# EAGLE board Payload-A (EAGLE 8.6.3), part 1 of 2
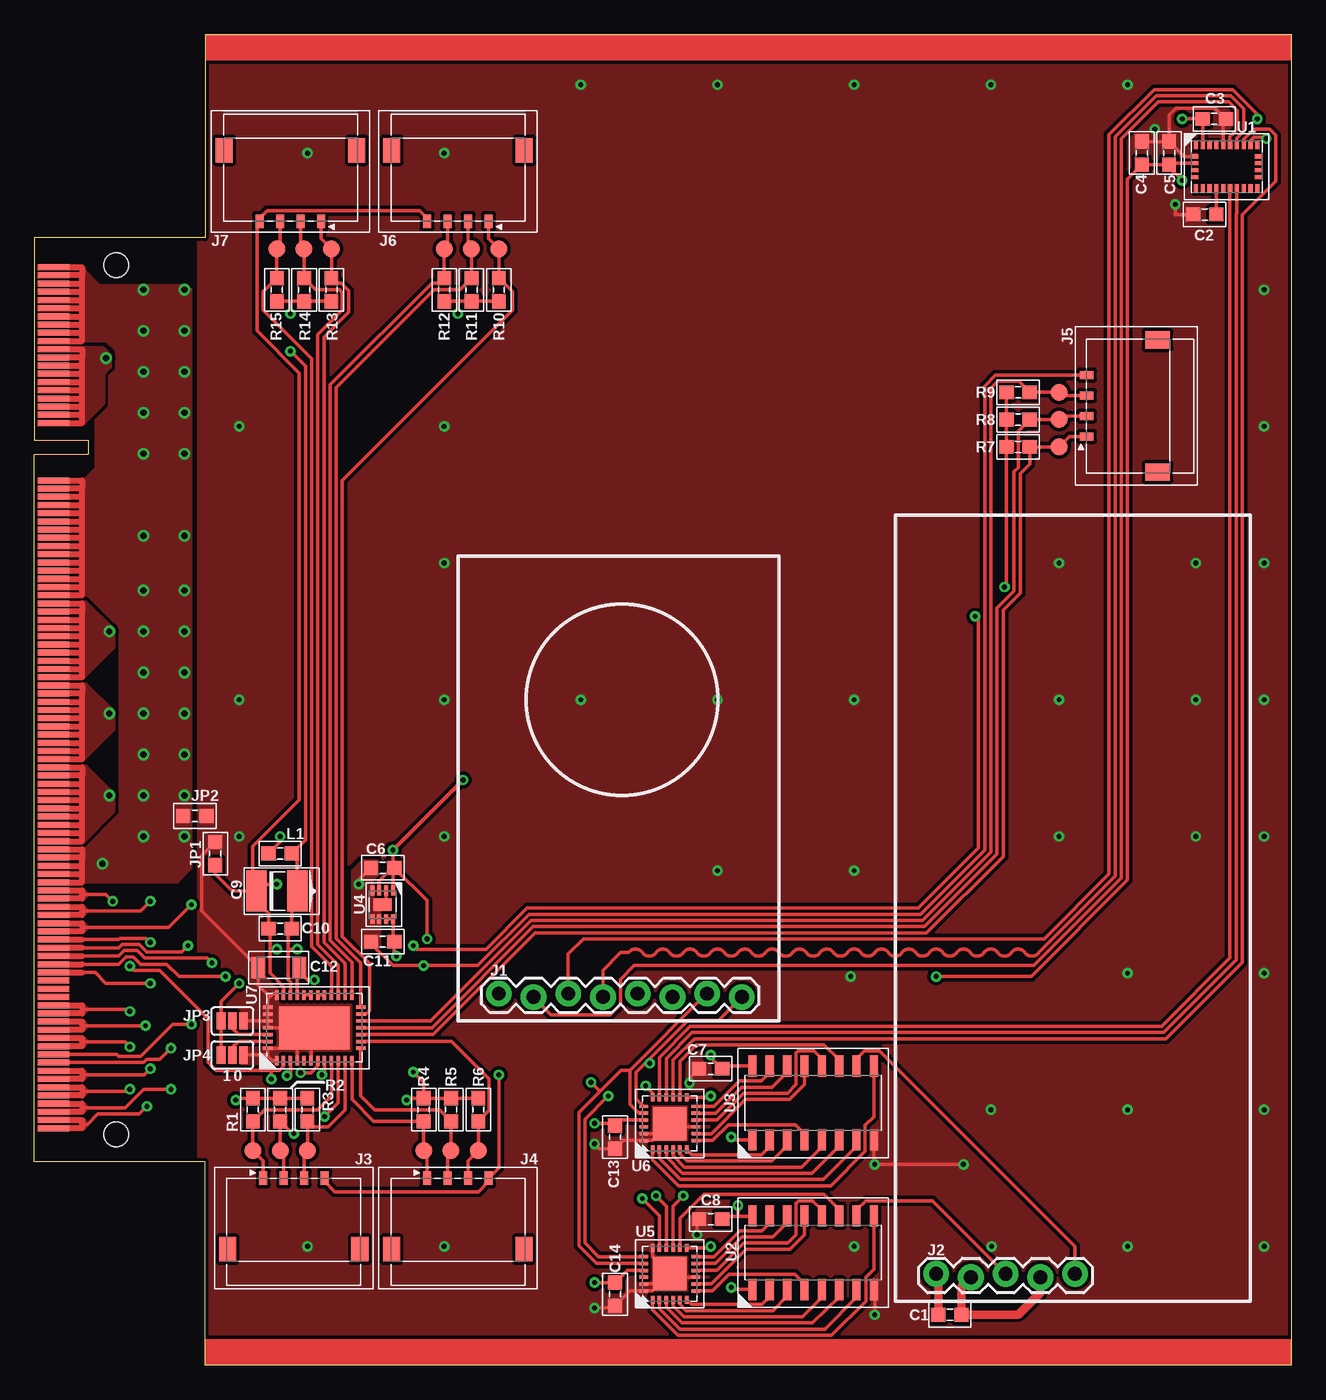
[diagram p1: board, top side]
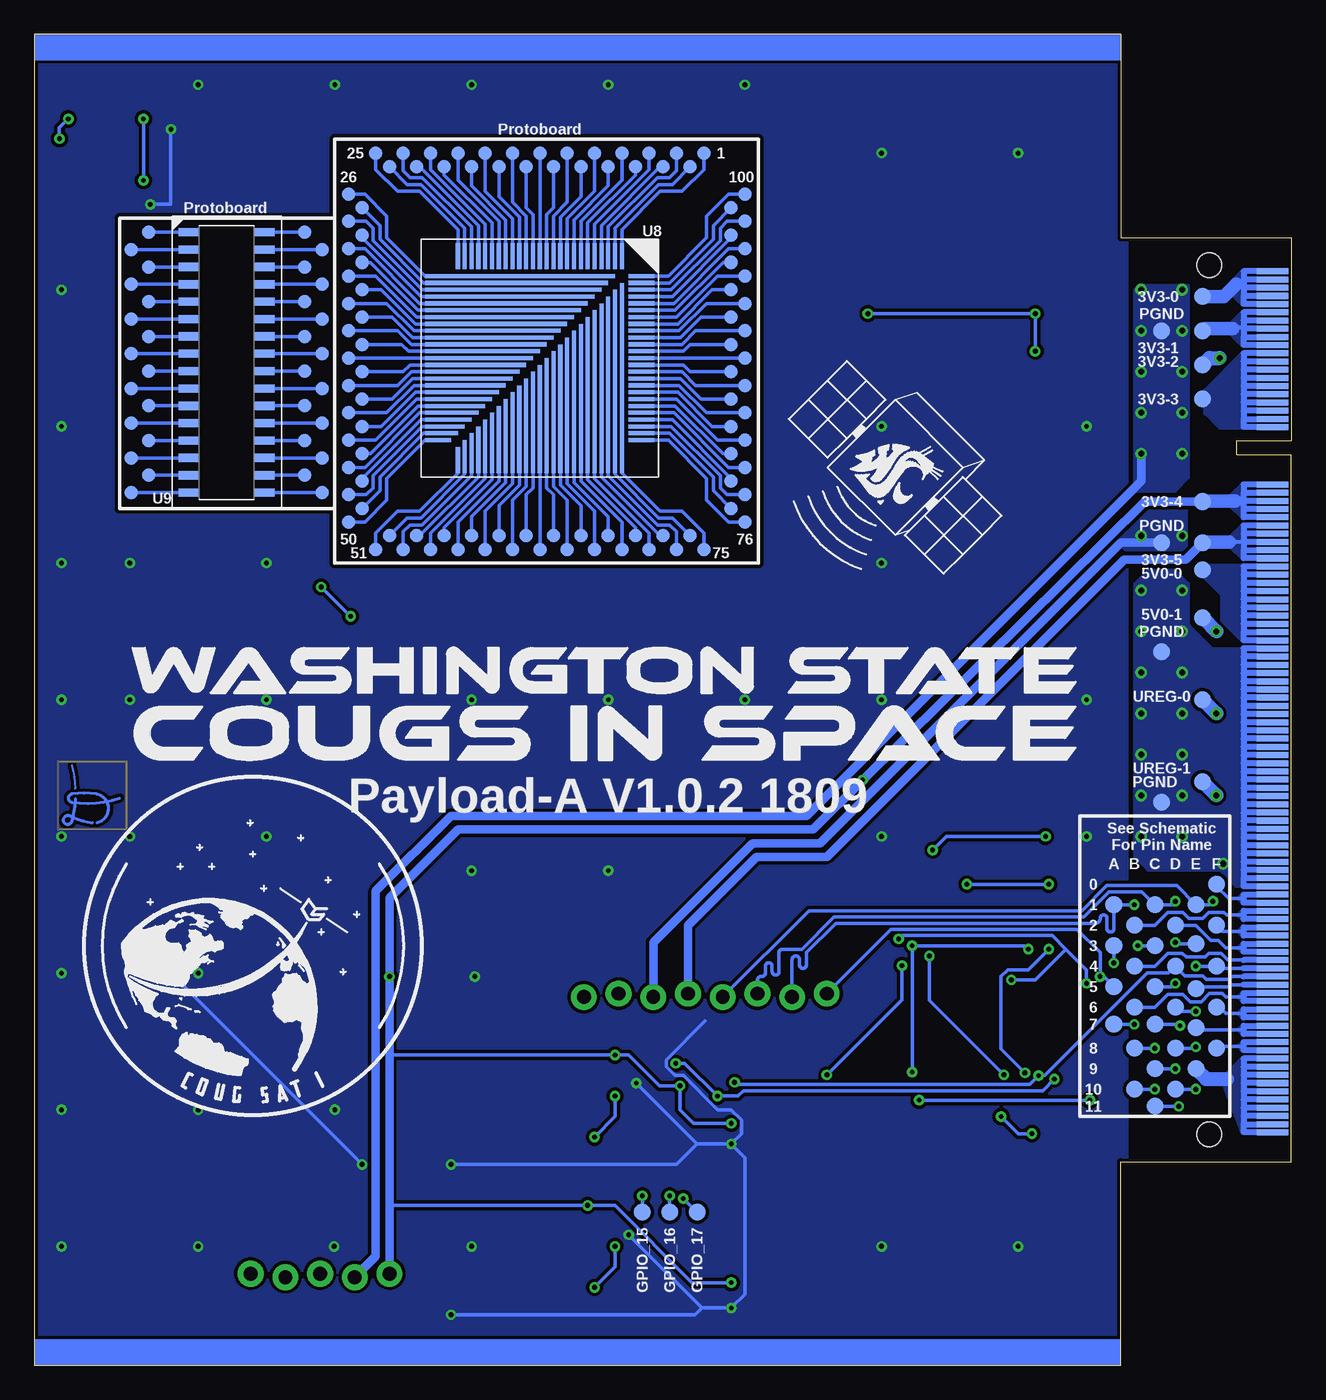
[diagram p2: board, bottom side, seen from below]

Size 92 x 97.4 mm. Coordinates in mm from the lower left corner, seen from the top.
Copper layers (1*16): Top 0.035mm / dielectric 0.9mm / Bottom 0.035mm
Design rules "JLCPCB": minimum track width 6mil, minimum drill 0.3mm, track to track 6mil, track to pad 6mil, pad to pad 6mil, via to via 6mil, smd to smd 6mil, copper to edge 8mil, drill to drill 6mil, minimum pad ring 10mil, minimum via ring 8mil, stop-mask expansion 4mil, vias tented up to drill 20mil, thermal gap 10mil
bRestrict: 8 lines

## Footprints (pad centres in the part's own frame; a part is rotated, then mirrored left to right if it is on the bottom)
1608 = smd 1.05 x 1: 1 -0.85,0; 2 0.85,0
4028-POL = smd 1.5 x 3: A 1.5,0; C -1.5,0
3216 = smd 1 x 1.6: 1 -1.5,0; 2 1.5,0
1X08_LOCK = drill 1.016 pad 1.88: 1 0,0; 2 2.54,-0.254; 3 5.08,0; 4 7.62,-0.254; 5 10.16,0; 6 12.7,-0.254; 7 15.24,0; 8 17.78,-0.254
1X05_LOCK = drill 1.016 pad 1.88: 1 0,0; 2 2.54,-0.254; 3 5.08,0; 4 7.62,-0.254; 5 10.16,0
1X04_PICOLOCK1.5MM = smd 0.6 x 1: 1 2.25,0; 2 0.75,0; 3 -0.75,0; 4 -2.25,0 | smd 1.25 x 1.8: PAD@1 4.855,5.2; PAD@2 -4.833,5.2
COUGSATBUS_MALE-SODIMM = smd 2.3 x 0.44: 1 1.4,31.65; 3 1.4,31.05; 5 1.4,30.45; 7 1.4,29.85; 9 1.4,29.25; 11 1.4,28.65; 13 1.4,28.05; 15 1.4,27.45; 17 1.4,26.85; 19 1.4,26.25; 21 1.4,25.65; 23 1.4,25.05; 25 1.4,24.45; 27 1.4,23.85; 29 1.4,23.25; 31 1.4,22.65; 33 1.4,22.05; 35 1.4,21.45; 37 1.4,20.85; 39 1.4,20.25; 41 1.4,16.05; 43 1.4,15.45; 45 1.4,14.85; 47 1.4,14.25; 49 1.4,13.65; 51 1.4,13.05; 53 1.4,12.45; 55 1.4,11.85; 57 1.4,11.25; 59 1.4,10.65; 61 1.4,10.05; 63 1.4,9.45; 65 1.4,8.85; 67 1.4,8.25; 69 1.4,7.65; 71 1.4,7.05; 73 1.4,6.45; 75 1.4,5.85; 77 1.4,5.25; 79 1.4,4.65; 81 1.4,4.05; 83 1.4,3.45; 85 1.4,2.85; 87 1.4,2.25; 89 1.4,1.65; 91 1.4,1.05; 93 1.4,0.45; 95 1.4,-0.15; 97 1.4,-0.75; 99 1.4,-1.35; 101 1.4,-1.95; 103 1.4,-2.55; 105 1.4,-3.15; 107 1.4,-3.75; 109 1.4,-4.35; 111 1.4,-4.95; 113 1.4,-5.55; 115 1.4,-6.15; 117 1.4,-6.75; 119 1.4,-7.35; 121 1.4,-7.95; 123 1.4,-8.55; 125 1.4,-9.15; 127 1.4,-9.75; 129 1.4,-10.35; 131 1.4,-10.95; 133 1.4,-11.55; 135 1.4,-12.15; 137 1.4,-12.75; 139 1.4,-13.35; 141 1.4,-13.95; 143 1.4,-14.55; 145 1.4,-15.15; 147 1.4,-15.75; 149 1.4,-16.35; 151 1.4,-16.95; 153 1.4,-17.55; 155 1.4,-18.15; 157 1.4,-18.75; 159 1.4,-19.35; 161 1.4,-19.95; 163 1.4,-20.55; 165 1.4,-21.15; 167 1.4,-21.75; 169 1.4,-22.35; 171 1.4,-22.95; 173 1.4,-23.55; 175 1.4,-24.15; 177 1.4,-24.75; 179 1.4,-25.35; 181 1.4,-25.95; 183 1.4,-26.55; 185 1.4,-27.15; 187 1.4,-27.75; 189 1.4,-28.35; 191 1.4,-28.95; 193 1.4,-29.55; 195 1.4,-30.15; 197 1.4,-30.75; 199 1.4,-31.35 | smd 2.3 x 0.44 bottom: 2 1.4,31.35; 4 1.4,30.75; 6 1.4,30.15; 8 1.4,29.55; 10 1.4,28.95; 12 1.4,28.35; 14 1.4,27.75; 16 1.4,27.15; 18 1.4,26.55; 20 1.4,25.95; 22 1.4,25.35; 24 1.4,24.75; 26 1.4,24.15; 28 1.4,23.55; 30 1.4,22.95; 32 1.4,22.35; 34 1.4,21.75; 36 1.4,21.15; 38 1.4,20.55; 40 1.4,19.95; 42 1.4,15.75; 44 1.4,15.15; 46 1.4,14.55; 48 1.4,13.95; 50 1.4,13.35; 52 1.4,12.75; 54 1.4,12.15; 56 1.4,11.55; 58 1.4,10.95; 60 1.4,10.35; 62 1.4,9.75; 64 1.4,9.15; 66 1.4,8.55; 68 1.4,7.95; 70 1.4,7.35; 72 1.4,6.75; 74 1.4,6.15; 76 1.4,5.55; 78 1.4,4.95; 80 1.4,4.35; 82 1.4,3.75; 84 1.4,3.15; 86 1.4,2.55; 88 1.4,1.95; 90 1.4,1.35; 92 1.4,0.75; 94 1.4,0.15; 96 1.4,-0.45; 98 1.4,-1.05; 100 1.4,-1.65; 102 1.4,-2.25; 104 1.4,-2.85; 106 1.4,-3.45; 108 1.4,-4.05; 110 1.4,-4.65; 112 1.4,-5.25; 114 1.4,-5.85; 116 1.4,-6.45; 118 1.4,-7.05; 120 1.4,-7.65; 122 1.4,-8.25; 124 1.4,-8.85; 126 1.4,-9.45; 128 1.4,-10.05; 130 1.4,-10.65; 132 1.4,-11.25; 134 1.4,-11.85; 136 1.4,-12.45; 138 1.4,-13.05; 140 1.4,-13.65; 142 1.4,-14.25; 144 1.4,-14.85; 146 1.4,-15.45; 148 1.4,-16.05; 150 1.4,-16.65; 152 1.4,-17.25; 154 1.4,-17.85; 156 1.4,-18.45; 158 1.4,-19.05; 160 1.4,-19.65; 162 1.4,-20.25; 164 1.4,-20.85; 166 1.4,-21.45; 168 1.4,-22.05; 170 1.4,-22.65; 172 1.4,-23.25; 174 1.4,-23.85; 176 1.4,-24.45; 178 1.4,-25.05; 180 1.4,-25.65; 182 1.4,-26.25; 184 1.4,-26.85; 186 1.4,-27.45; 188 1.4,-28.05; 190 1.4,-28.65; 192 1.4,-29.25; 194 1.4,-29.85; 196 1.4,-30.45; 198 1.4,-31.05; 200 1.4,-31.65 | hole 1.8: 6,31.8; 6,-31.8
SMT-JUMPER_3_NO_SILK = smd 0.635 x 1.27: 1 -0.813,0; 2 0,0; 3 0.813,0
PAD1.25X1.25 = smd 1.25 x 1.25: 1 0,0
PAD1X1 = smd 1 x 1: 1 0,0
LGA28-4X5MM = smd 0.3 x 0.575: 1 -2.25,1.562; 6 -2.25,-1.562; 7 -1.75,-1.562; 8 -1.25,-1.562; 9 -0.75,-1.562; 10 -0.25,-1.562; 11 0.25,-1.562; 12 0.75,-1.562; 13 1.25,-1.562; 14 1.75,-1.562; 15 2.25,-1.562; 20 2.25,1.562; 21 1.75,1.562; 22 1.25,1.562; 23 0.75,1.562; 24 0.25,1.562; 25 -0.25,1.562; 26 -0.75,1.562; 27 -1.25,1.562; 28 -1.75,1.562 | smd 0.475 x 0.3: 2 -2.312,0.75; 3 -2.312,0.25; 4 -2.312,-0.25; 5 -2.312,-0.75; 16 2.312,-0.75; 17 2.312,-0.25; 18 2.312,0.25; 19 2.312,0.75
SO16 = smd 1.55 x 0.6: 1 -2.7,4.445; 2 -2.7,3.175; 3 -2.7,1.905; 4 -2.7,0.635; 5 -2.7,-0.635; 6 -2.7,-1.905; 7 -2.7,-3.175; 8 -2.7,-4.445; 9 2.7,-4.445; 10 2.7,-3.175; 11 2.7,-1.905; 12 2.7,-0.635; 13 2.7,0.635; 14 2.7,1.905; 15 2.7,3.175; 16 2.7,4.445
WDFN8-2X2 = smd 0.7 x 0.29: 1 -1.05,0.75; 2 -1.05,0.25; 3 -1.05,-0.25; 4 -1.05,-0.75; 5 1.05,-0.75; 6 1.05,-0.25; 7 1.05,0.25; 8 1.05,0.75 | smd 0.9 x 1.3: PAD 0,0
QFN24-4X4 = smd 0.6 x 0.25: 1 -1.9,1.25; 2 -1.9,0.75; 3 -1.9,0.25; 4 -1.9,-0.25; 5 -1.9,-0.75; 6 -1.9,-1.25; 13 1.9,-1.25; 14 1.9,-0.75; 15 1.9,-0.25; 16 1.9,0.25; 17 1.9,0.75; 18 1.9,1.25 | smd 0.25 x 0.6: 7 -1.25,-1.9; 8 -0.75,-1.9; 9 -0.25,-1.9; 10 0.25,-1.9; 11 0.75,-1.9; 12 1.25,-1.9; 19 1.25,1.9; 20 0.75,1.9; 21 0.25,1.9; 22 -0.25,1.9; 23 -0.75,1.9; 24 -1.25,1.9 | smd 2.45 x 2.45: PAD 0,0
QFN38-5X7 = smd 0.25 x 0.7: 1 -2.75,-2.4; 2 -2.25,-2.4; 3 -1.75,-2.4; 4 -1.25,-2.4; 5 -0.75,-2.4; 6 -0.25,-2.4; 7 0.25,-2.4; 8 0.75,-2.4; 9 1.25,-2.4; 10 1.75,-2.4; 11 2.25,-2.4; 12 2.75,-2.4; 20 2.75,2.4; 21 2.25,2.4; 22 1.75,2.4; 23 1.25,2.4; 24 0.75,2.4; 25 0.25,2.4; 26 -0.25,2.4; 27 -0.75,2.4; 28 -1.25,2.4; 29 -1.75,2.4; 30 -2.25,2.4; 31 -2.75,2.4 | smd 0.7 x 0.25: 13 3.4,-1.5; 14 3.4,-1; 15 3.4,-0.5; 16 3.4,0; 17 3.4,0.5; 18 3.4,1; 19 3.4,1.5; 32 -3.4,1.5; 33 -3.4,1; 34 -3.4,0.5; 35 -3.4,0; 36 -3.4,-0.5; 37 -3.4,-1; 38 -3.4,-1.5 | smd 5.15 x 3.15: PAD 0,0
PROTOBOARD-SMD0.5MM = smd 0.3 x 1.9: 1 -6,-7.45; 2 -5.5,-7.45; 3 -5,-7.45; 4 -4.5,-7.45; 5 -4,-7.45; 6 -3.5,-7.45; 7 -3,-7.45; 8 -2.5,-7.45; 9 -2,-7.45; 10 -1.5,-7.45; 11 -1,-7.45; 12 -0.5,-7.45; 13 0,-7.45; 14 0.5,-7.45; 15 1,-7.45; 16 1.5,-7.45; 17 2,-7.45; 18 2.5,-7.45; 19 3,-7.45; 20 3.5,-7.45; 21 4,-7.45; 22 4.5,-7.45; 23 5,-7.45; 24 5.5,-7.45; 25 6,-7.45; 51 6,7.45 | smd 13.9 x 0.3: 26 1.45,-6 | smd 13.4 x 0.3: 27 1.7,-5.5 | smd 12.9 x 0.3: 28 1.95,-5 | smd 12.4 x 0.3: 29 2.2,-4.5 | smd 11.9 x 0.3: 30 2.45,-4 | smd 11.4 x 0.3: 31 2.7,-3.5 | smd 10.9 x 0.3: 32 2.95,-3 | smd 10.4 x 0.3: 33 3.2,-2.5 | smd 9.9 x 0.3: 34 3.45,-2 | smd 9.4 x 0.3: 35 3.7,-1.5 | smd 8.9 x 0.3: 36 3.95,-1 | smd 8.4 x 0.3: 37 4.2,-0.5 | smd 7.9 x 0.3: 38 4.45,0 | smd 7.4 x 0.3: 39 4.7,0.5 | smd 6.9 x 0.3: 40 4.95,1 | smd 6.4 x 0.3: 41 5.2,1.5 | smd 5.9 x 0.3: 42 5.45,2 | smd 5.4 x 0.3: 43 5.7,2.5 | smd 4.9 x 0.3: 44 5.95,3 | smd 4.4 x 0.3: 45 6.2,3.5 | smd 3.9 x 0.3: 46 6.45,4 | smd 3.4 x 0.3: 47 6.7,4.5 | smd 2.9 x 0.3: 48 6.95,5 | smd 2.4 x 0.3: 49 7.2,5.5 | smd 1.9 x 0.3: 50 7.45,6; 76 -7.45,6; 77 -7.45,5.5; 78 -7.45,5; 79 -7.45,4.5; 80 -7.45,4; 81 -7.45,3.5; 82 -7.45,3; 83 -7.45,2.5; 84 -7.45,2; 85 -7.45,1.5; 86 -7.45,1; 87 -7.45,0.5; 88 -7.45,0; 89 -7.45,-0.5; 90 -7.45,-1; 91 -7.45,-1.5; 92 -7.45,-2; 93 -7.45,-2.5; 94 -7.45,-3; 95 -7.45,-3.5; 96 -7.45,-4; 97 -7.45,-4.5; 98 -7.45,-5; 99 -7.45,-5.5; 100 -7.45,-6 | smd 0.3 x 2.4: 52 5.5,7.2 | smd 0.3 x 2.9: 53 5,6.95 | smd 0.3 x 3.4: 54 4.5,6.7 | smd 0.3 x 3.9: 55 4,6.45 | smd 0.3 x 4.4: 56 3.5,6.2 | smd 0.3 x 4.9: 57 3,5.95 | smd 0.3 x 5.4: 58 2.5,5.7 | smd 0.3 x 5.9: 59 2,5.45 | smd 0.3 x 6.4: 60 1.5,5.2 | smd 0.3 x 6.9: 61 1,4.95 | smd 0.3 x 7.4: 62 0.5,4.7 | smd 0.3 x 7.9: 63 0,4.45 | smd 0.3 x 8.4: 64 -0.5,4.2 | smd 0.3 x 8.9: 65 -1,3.95 | smd 0.3 x 9.4: 66 -1.5,3.7 | smd 0.3 x 9.9: 67 -2,3.45 | smd 0.3 x 10.4: 68 -2.5,3.2 | smd 0.3 x 10.9: 69 -3,2.95 | smd 0.3 x 11.4: 70 -3.5,2.7 | smd 0.3 x 11.9: 71 -4,2.45 | smd 0.3 x 12.4: 72 -4.5,2.2 | smd 0.3 x 12.9: 73 -5,1.95 | smd 0.3 x 13.4: 74 -5.5,1.7 | smd 0.3 x 13.9: 75 -6,1.45
PROTOBOARD-SOIC = smd 0.6 x 1.52: 1 -3.81,-2.76; 2 -2.54,-2.76; 3 -1.27,-2.76; 4 0,-2.76; 5 1.27,-2.76; 6 2.54,-2.76; 7 3.81,-2.76; 8 5.08,-2.76; 9 6.35,-2.76; 10 7.62,-2.76; 11 8.89,-2.76; 12 10.16,-2.76; 13 11.43,-2.76; 14 12.7,-2.76; 15 13.97,-2.76; 16 15.24,-2.76; 17 15.24,2.76; 18 13.97,2.76; 19 12.7,2.76; 20 11.43,2.76; 21 10.16,2.76; 22 8.89,2.76; 23 7.62,2.76; 24 6.35,2.76; 25 5.08,2.76; 26 3.81,2.76; 27 2.54,2.76; 28 1.27,2.76; 29 0,2.76; 30 -1.27,2.76; 31 -2.54,2.76; 32 -3.81,2.76

## Placement (x,y rotation side)
C1  100nF  [1608]  67,3.7 0 top
C2  100nF  [1608]  85.65,84.2 180 top
C3  100nF  [1608]  86.35,91.2 0 top
C4  100nF  [1608]  81.05,88.7 90 top
C5  6.8nF  [1608]  83.05,88.7 90 top
C6  100nF  [1608]  25.5,36.4 180 top
C7  100nF  [1608]  49.5,21.7 180 top
C8  100nF  [1608]  49.5,10.7 180 top
C9  10µF  [4028-POL]  17.75,34.7 0 top
C10  100nF  [1608]  18,31.95 180 top
C11  270pF  [1608]  25.5,31 180 top
C12  100nF  [3216]  17.9,29.1 180 top
C13  100nF  [1608]  42.5,16.7 270 top
C14  100nF  [1608]  42.5,5.2 270 top
IMG1  COUGSINSPACELOGOTEXT  [COUGSINSPACETEXT]  50,48.7 0 bottom
IMG2  COUGSINSPACELOGOSMALL  [COUGSINSPACELOGO_SMALL]  29,65.7 0 bottom
IMG3  COUGSINSPACELOGOMEDIUM  [COUGSINSPACELOGO_MEDIUM]  76,30.7 0 bottom
IMG4  SIGNATUREBRADLEY  [SIGNATURE-BRADLEY]  87.75,41.7 0 bottom
J1  ArduCAM Mini 5MP  [1X08_LOCK]  34,27.2 0 top
J2  CONN_05TH-LOCK  [1X05_LOCK]  66,6.7 0 top
J3  [1X04_PICOLOCK1.5MM]  19,13.7 180 top
J4  [1X04_PICOLOCK1.5MM]  31,13.7 180 top
J5  [1X04_PICOLOCK1.5MM]  77,70.2 270 top
J6  [1X04_PICOLOCK1.5MM]  31,83.7 0 top
J7  [1X04_PICOLOCK1.5MM]  18.75,83.7 0 top
J8  COUGSATBUSCARD  [COUGSATBUS_MALE-SODIMM]  0,48.7 0 top
JP1  [1608]  13.25,37.45 90 top
JP2  [1608]  11.75,40.2 180 top
JP3  [SMT-JUMPER_3_NO_SILK]  14.5,25.2 0 top
JP4  [SMT-JUMPER_3_NO_SILK]  14.5,22.7 0 top
L1  BLM18HE152SN1  [1608]  18,37.45 180 top
R1  220kΩ  [1608]  16,18.7 90 top
R2  220kΩ  [1608]  18,18.7 90 top
R3  220kΩ  [1608]  20,18.7 90 top
R4  220kΩ  [1608]  28.5,18.7 90 top
R5  220kΩ  [1608]  30.5,18.7 90 top
R6  220kΩ  [1608]  32.5,18.7 90 top
R7  220kΩ  [1608]  72,67.2 180 top
R8  220kΩ  [1608]  72,69.2 180 top
R9  220kΩ  [1608]  72,71.2 180 top
R10  220kΩ  [1608]  34,78.7 270 top
R11  220kΩ  [1608]  32,78.7 270 top
R12  220kΩ  [1608]  30,78.7 270 top
R13  220kΩ  [1608]  21.75,78.7 270 top
R14  220kΩ  [1608]  19.75,78.7 270 top
R15  220kΩ  [1608]  17.75,78.7 270 top
TP1  [PAD1.25X1.25]  47.5,11.2 0 bottom
TP2  [PAD1.25X1.25]  45.5,11.2 0 bottom
TP3  [PAD1.25X1.25]  43.5,11.2 0 bottom
TP4  [PAD1.25X1.25]  16,15.7 0 top
TP5  [PAD1.25X1.25]  18,15.7 0 top
TP6  [PAD1.25X1.25]  20,15.7 0 top
TP7  [PAD1.25X1.25]  28.5,15.7 0 top
TP8  [PAD1.25X1.25]  30.5,15.7 0 top
TP9  [PAD1.25X1.25]  32.5,15.7 0 top
TP10  [PAD1.25X1.25]  75,67.2 0 top
TP11  [PAD1.25X1.25]  75,69.2 0 top
TP12  [PAD1.25X1.25]  75,71.2 0 top
TP13  [PAD1.25X1.25]  34,81.7 90 top
TP14  [PAD1.25X1.25]  32,81.7 90 top
TP15  [PAD1.25X1.25]  30,81.7 90 top
TP16  [PAD1.25X1.25]  21.75,81.7 180 top
TP17  [PAD1.25X1.25]  19.75,81.7 180 top
TP18  [PAD1.25X1.25]  17.75,81.7 180 top
TP19  [PAD1.25X1.25]  10,24.95 0 bottom
TP20  [PAD1.25X1.25]  8.5,26.2 0 bottom
TP21  [PAD1.25X1.25]  8.5,23.2 270 bottom
TP22  [PAD1.25X1.25]  5.5,29.2 270 bottom
TP23  [PAD1.25X1.25]  8.5,29.2 270 bottom
TP24  [PAD1.25X1.25]  7,27.55 270 bottom
TP25  [PAD1.25X1.25]  10,21.7 270 bottom
TP26  [PAD1.25X1.25]  8.5,20.2 270 bottom
TP27  [PAD1.25X1.25]  11.5,20.2 270 bottom
TP28  [PAD1.25X1.25]  10,18.95 270 bottom
TP29  [PAD1.25X1.25]  10,33.7 270 bottom
TP30  [PAD1.25X1.25]  13,33.7 270 bottom
TP31  [PAD1.25X1.25]  7,33.7 270 bottom
TP32  [PAD1.25X1.25]  7,24.7 270 bottom
TP33  [PAD1.25X1.25]  5.5,23.2 270 bottom
TP34  [PAD1.25X1.25]  7,30.85 270 bottom
TP35  [PAD1.25X1.25]  10,30.7 270 bottom
TP36  [PAD1.25X1.25]  13,30.7 270 bottom
TP37  [PAD1.25X1.25]  11.5,29.2 270 bottom
TP38  [PAD1.25X1.25]  13,27.7 270 bottom
TP39  [PAD1.25X1.25]  10,27.7 270 bottom
TP40  [PAD1X1]  43,88.7 0 bottom
TP41  [PAD1X1]  44,87.7 0 bottom
TP42  [PAD1X1]  45,88.7 0 bottom
TP43  [PAD1X1]  46,87.7 270 bottom
TP44  [PAD1X1]  47,88.7 270 bottom
TP45  [PAD1X1]  48,87.7 270 bottom
TP46  [PAD1X1]  49,88.7 270 bottom
TP47  [PAD1X1]  50,87.7 270 bottom
TP48  [PAD1X1]  51,88.7 270 bottom
TP49  [PAD1X1]  52,87.7 270 bottom
TP50  [PAD1X1]  67,59.7 90 bottom
TP51  [PAD1X1]  66,60.7 90 bottom
TP52  [PAD1X1]  65,59.7 90 bottom
TP53  [PAD1X1]  64,60.7 90 bottom
TP54  [PAD1X1]  63,59.7 90 bottom
TP55  [PAD1X1]  62,60.7 90 bottom
TP56  [PAD1X1]  61,59.7 90 bottom
TP57  [PAD1X1]  60,60.7 90 bottom
TP58  [PAD1X1]  59,59.7 90 bottom
TP59  [PAD1X1]  58,60.7 90 bottom
TP60  [PAD1X1]  53,88.7 270 bottom
TP61  [PAD1X1]  54,87.7 270 bottom
TP62  [PAD1X1]  55,88.7 270 bottom
TP63  [PAD1X1]  56,87.7 270 bottom
TP64  [PAD1X1]  57,88.7 270 bottom
TP65  [PAD1X1]  58,87.7 270 bottom
TP66  [PAD1X1]  59,88.7 270 bottom
TP67  [PAD1X1]  60,87.7 270 bottom
TP68  [PAD1X1]  61,88.7 270 bottom
TP69  [PAD1X1]  62,87.7 270 bottom
TP70  [PAD1X1]  57,59.7 90 bottom
TP71  [PAD1X1]  56,60.7 90 bottom
TP72  [PAD1X1]  55,59.7 90 bottom
TP73  [PAD1X1]  54,60.7 90 bottom
TP74  [PAD1X1]  53,59.7 90 bottom
TP75  [PAD1X1]  52,60.7 90 bottom
TP76  [PAD1X1]  51,59.7 90 bottom
TP77  [PAD1X1]  50,60.7 90 bottom
TP78  [PAD1X1]  49,59.7 90 bottom
TP79  [PAD1X1]  48,60.7 90 bottom
TP80  [PAD1.25X1.25]  11.5,26.2 270 bottom
TP81  [PAD1.25X1.25]  5.5,26.2 270 bottom
TP82  [PAD1.25X1.25]  9.5,41.2 270 bottom
TP83  [PAD1.25X1.25]  9.5,52.2 270 bottom
TP84  [PAD1.25X1.25]  9.5,60.2 270 bottom
TP85  [PAD1.25X1.25]  9.5,75.7 270 bottom
TP86  [PAD1.25X1.25]  6.5,63.2 270 bottom
TP87  [PAD1.25X1.25]  6.5,60.2 270 bottom
TP88  [PAD1.25X1.25]  8.5,32.2 270 bottom
TP89  [PAD1.25X1.25]  5.5,32.2 270 bottom
TP90  [PAD1.25X1.25]  11.5,32.2 270 bottom
TP91  [PAD1.25X1.25]  5.5,35.2 270 bottom
TP92  [PAD1.25X1.25]  13,24.95 0 bottom
TP93  [PAD1.25X1.25]  11.5,23.2 0 bottom
TP94  [PAD1X1]  63,88.7 270 bottom
TP95  [PAD1X1]  64,87.7 270 bottom
TP96  [PAD1X1]  65,88.7 270 bottom
TP97  [PAD1X1]  66,87.7 270 bottom
TP98  [PAD1X1]  67,88.7 270 bottom
TP99  [PAD1X1]  69,85.7 270 bottom
TP100  [PAD1X1]  68,84.7 0 bottom
TP101  [PAD1X1]  69,83.7 0 bottom
TP102  [PAD1X1]  68,82.7 0 bottom
TP103  [PAD1X1]  69,81.7 0 bottom
TP104  [PAD1X1]  47,59.7 90 bottom
TP105  [PAD1X1]  46,60.7 90 bottom
TP106  [PAD1X1]  45,59.7 90 bottom
TP107  [PAD1X1]  44,60.7 90 bottom
TP108  [PAD1X1]  43,59.7 180 bottom
TP109  [PAD1X1]  40,61.7 180 bottom
TP110  [PAD1X1]  41,62.7 180 bottom
TP111  [PAD1X1]  40,63.7 180 bottom
TP112  [PAD1X1]  41,64.7 180 bottom
TP113  [PAD1X1]  40,65.7 180 bottom
TP114  [PAD1X1]  68,80.7 0 bottom
TP115  [PAD1X1]  69,79.7 0 bottom
TP116  [PAD1X1]  68,78.7 0 bottom
TP117  [PAD1X1]  69,77.7 0 bottom
TP118  [PAD1X1]  68,76.7 0 bottom
TP119  [PAD1X1]  69,75.7 0 bottom
TP120  [PAD1X1]  68,74.7 0 bottom
TP121  [PAD1X1]  69,73.7 0 bottom
TP122  [PAD1X1]  68,72.7 0 bottom
TP123  [PAD1X1]  69,71.7 0 bottom
TP124  [PAD1X1]  41,66.7 180 bottom
TP125  [PAD1X1]  40,67.7 180 bottom
TP126  [PAD1X1]  41,68.7 180 bottom
TP127  [PAD1X1]  40,69.7 180 bottom
TP128  [PAD1X1]  41,70.7 180 bottom
TP129  [PAD1X1]  40,71.7 180 bottom
TP130  [PAD1X1]  41,72.7 180 bottom
TP131  [PAD1X1]  40,73.7 180 bottom
TP132  [PAD1X1]  41,74.7 180 bottom
TP133  [PAD1X1]  40,75.7 180 bottom
TP134  [PAD1X1]  68,70.7 0 bottom
TP135  [PAD1X1]  69,69.7 0 bottom
TP136  [PAD1X1]  68,68.7 0 bottom
TP137  [PAD1X1]  69,67.7 0 bottom
TP138  [PAD1X1]  68,66.7 0 bottom
TP139  [PAD1X1]  69,65.7 0 bottom
TP140  [PAD1X1]  68,64.7 0 bottom
TP141  [PAD1X1]  69,63.7 0 bottom
TP142  [PAD1X1]  68,62.7 0 bottom
TP143  [PAD1X1]  69,61.7 0 bottom
TP144  [PAD1X1]  41,76.7 180 bottom
TP145  [PAD1X1]  40,77.7 180 bottom
TP146  [PAD1X1]  41,78.7 180 bottom
TP147  [PAD1X1]  40,79.7 180 bottom
TP148  [PAD1X1]  41,80.7 180 bottom
TP149  [PAD1X1]  40,81.7 180 bottom
TP150  [PAD1X1]  41,82.7 180 bottom
TP151  [PAD1X1]  40,83.7 180 bottom
TP152  [PAD1X1]  41,84.7 180 bottom
TP153  [PAD1X1]  40,85.7 0 bottom
TP154  [PAD1X1]  83.62,82.91 0 bottom
TP155  [PAD1X1]  84.89,81.64 0 bottom
TP156  [PAD1X1]  83.62,80.37 0 bottom
TP157  [PAD1X1]  84.89,79.09 0 bottom
TP158  [PAD1X1]  83.62,77.83 0 bottom
TP159  [PAD1X1]  84.89,76.56 0 bottom
TP160  [PAD1X1]  83.62,75.28 0 bottom
TP161  [PAD1X1]  84.89,74.02 0 bottom
TP162  [PAD1X1]  70.92,63.86 0 bottom
TP163  [PAD1X1]  72.19,65.12 180 bottom
TP164  [PAD1X1]  70.92,66.4 0 bottom
TP165  [PAD1X1]  72.19,67.67 180 bottom
TP166  [PAD1X1]  70.92,68.94 0 bottom
TP167  [PAD1X1]  72.19,70.2 180 bottom
TP168  [PAD1X1]  70.92,71.47 0 bottom
TP169  [PAD1X1]  72.19,72.75 180 bottom
TP170  [PAD1X1]  83.62,72.75 0 bottom
TP171  [PAD1X1]  84.89,71.47 180 bottom
TP172  [PAD1X1]  83.62,70.2 0 bottom
TP173  [PAD1X1]  84.89,68.94 180 bottom
TP174  [PAD1X1]  83.62,67.67 0 bottom
TP175  [PAD1X1]  84.89,66.4 180 bottom
TP176  [PAD1X1]  83.62,65.12 0 bottom
TP177  [PAD1X1]  84.89,63.86 180 bottom
TP178  [PAD1X1]  70.92,74.02 0 bottom
TP179  [PAD1X1]  72.19,75.28 180 bottom
TP180  [PAD1X1]  70.92,76.56 0 bottom
TP181  [PAD1X1]  72.19,77.83 180 bottom
TP182  [PAD1X1]  70.92,79.09 180 bottom
TP183  [PAD1X1]  72.19,80.37 180 bottom
TP184  [PAD1X1]  70.92,81.64 180 bottom
TP185  [PAD1X1]  72.19,82.91 180 bottom
TP186  [PAD1.25X1.25]  6.5,78.2 270 bottom
TP187  [PAD1.25X1.25]  6.5,75.7 270 bottom
TP188  [PAD1.25X1.25]  6.5,73.2 270 bottom
TP189  [PAD1.25X1.25]  6.5,70.7 270 bottom
TP190  [PAD1.25X1.25]  6.5,58.2 270 bottom
TP191  [PAD1.25X1.25]  6.5,54.7 270 bottom
TP192  [PAD1.25X1.25]  6.5,48.7 270 bottom
TP193  [PAD1.25X1.25]  6.5,42.7 270 bottom
TP194  [PAD1.25X1.25]  7,21.7 270 bottom
U1  BMF055  [LGA28-4X5MM]  87.25,87.7 0 top
U2  CD74HC4040M  [SO16]  57,8.25 90 top
U3  CD74HC4040M  [SO16]  57,19.2 90 top
U4  MCP1501-10  [WDFN8-2X2]  25.5,33.7 270 top
U5  TCA9535  [QFN24-4X4]  46.5,6.7 90 top
U6  TCA9535  [QFN24-4X4]  46.5,17.7 90 top
U7  LTC2499  [QFN38-5X7]  20.5,24.7 0 top
U8  [PROTOBOARD-SMD0.5MM]  55,73.7 180 bottom
U9  [PROTOBOARD-SOIC]  77.91,79.09 270 bottom